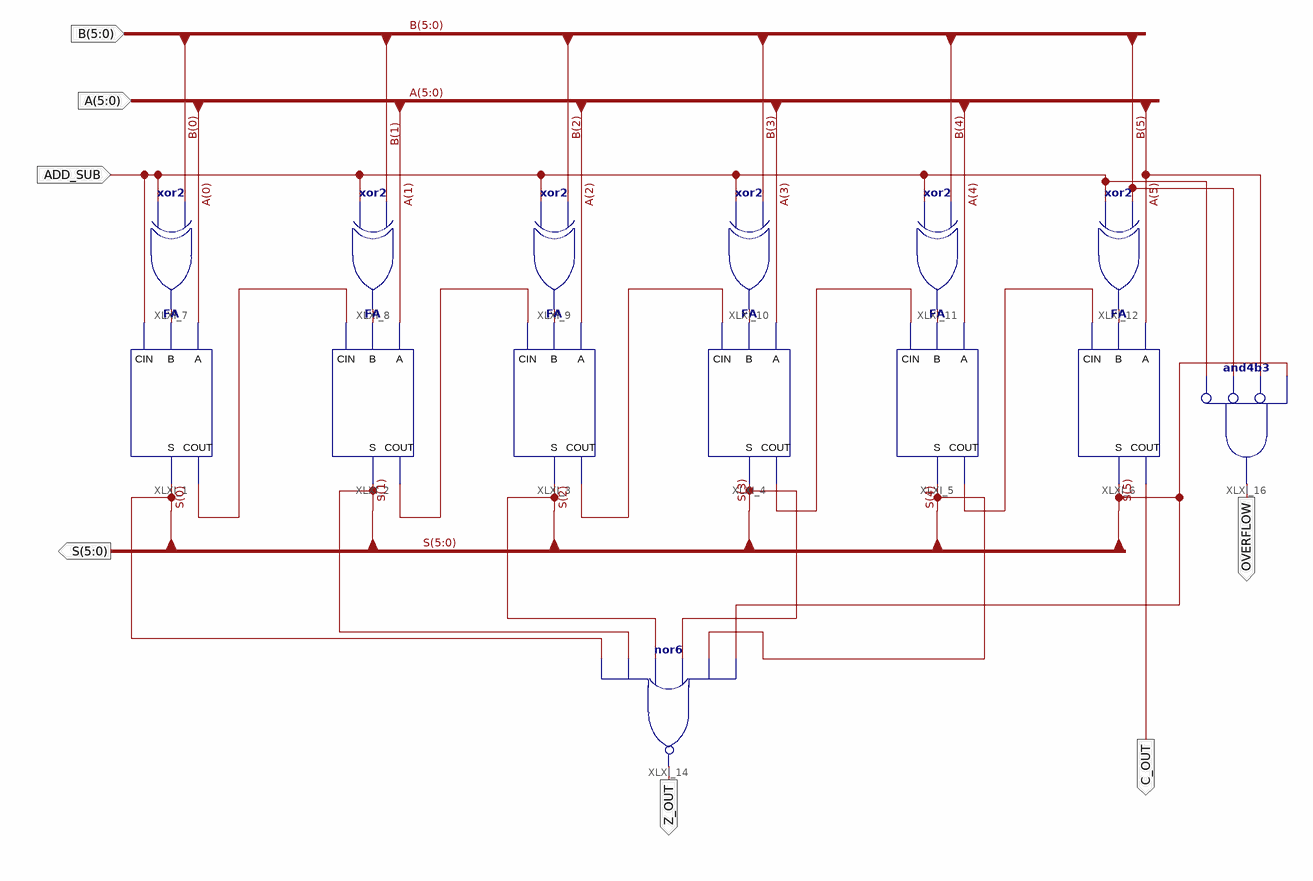
[diagram p0: schematic sheet 1]
// Xilinx ISE schematic AU_6BITS.sch (spartan3e) as structural Verilog: 14 symbols, 7 ports
module AU_6BITS (
  input  ADD_SUB,
  input  [5:0] A,
  input  [5:0] B,
  output [5:0] S,
  output Z_OUT,
  output OVERFLOW,
  output C_OUT
);

  wire XLXN_1, XLXN_2, XLXN_3, XLXN_4, XLXN_5, XLXN_6, XLXN_7, XLXN_8, XLXN_9, XLXN_10, XLXN_11;

  FA XLXI_1 (.A(A[0]), .B(XLXN_1), .CIN(ADD_SUB), .COUT(XLXN_7), .S(S[0]));
  FA XLXI_2 (.A(A[1]), .B(XLXN_2), .CIN(XLXN_7), .COUT(XLXN_8), .S(S[1]));
  FA XLXI_3 (.A(A[2]), .B(XLXN_3), .CIN(XLXN_8), .COUT(XLXN_9), .S(S[2]));
  FA XLXI_4 (.A(A[3]), .B(XLXN_4), .CIN(XLXN_9), .COUT(XLXN_10), .S(S[3]));
  FA XLXI_5 (.A(A[4]), .B(XLXN_5), .CIN(XLXN_10), .COUT(XLXN_11), .S(S[4]));
  FA XLXI_6 (.A(A[5]), .B(XLXN_6), .CIN(XLXN_11), .COUT(C_OUT), .S(S[5]));
  xor XLXI_7 (XLXN_1, ADD_SUB, B[0]);
  xor XLXI_8 (XLXN_2, ADD_SUB, B[1]);
  xor XLXI_9 (XLXN_3, ADD_SUB, B[2]);
  xor XLXI_10 (XLXN_4, ADD_SUB, B[3]);
  xor XLXI_11 (XLXN_5, ADD_SUB, B[4]);
  xor XLXI_12 (XLXN_6, ADD_SUB, B[5]);
  nor XLXI_14 (Z_OUT, S[0], S[1], S[2], S[3], S[4], S[5]);
  and XLXI_16 (OVERFLOW, ~ADD_SUB, ~B[5], ~A[5], S[5]);  // and4b3
endmodule
